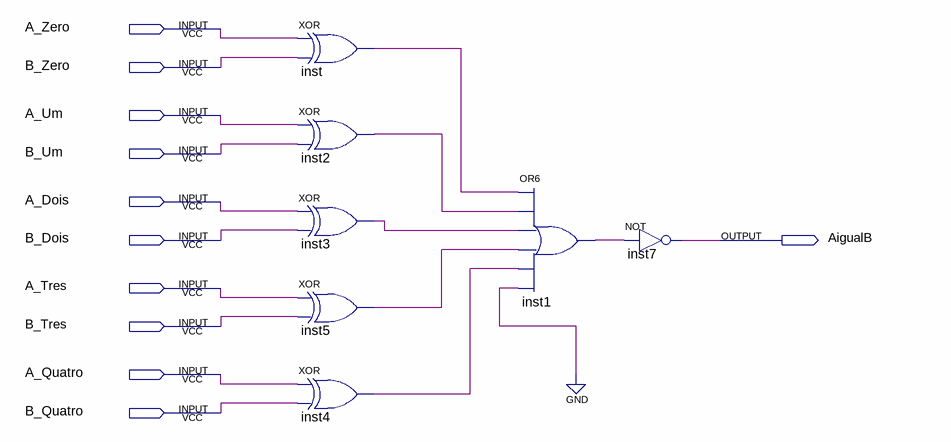
[diagram p0: schematic sheet]
// Quartus schematic A_Igual_B.bdf as structural Verilog: 7 symbols, 11 pins
module A_Igual_B (
  input  A_Zero,
  input  B_Zero,
  input  A_Um,
  input  B_Um,
  input  A_Dois,
  input  B_Dois,
  input  A_Tres,
  input  B_Tres,
  input  A_Quatro,
  input  B_Quatro,
  output AigualB
);

  wire inst1_out, inst2_out, inst3_out, inst4_out, inst5_out, inst_out;

  xor inst (inst_out, A_Zero, B_Zero);
  xor inst2 (inst2_out, A_Um, B_Um);
  xor inst3 (inst3_out, A_Dois, B_Dois);
  xor inst5 (inst5_out, A_Tres, B_Tres);
  xor inst4 (inst4_out, A_Quatro, B_Quatro);
  or inst1 (inst1_out, inst_out, inst2_out, inst3_out, inst5_out, inst4_out, 1'b0);
  not inst7 (AigualB, inst1_out);
endmodule
